# EAGLE schematic Battery-Connection (EAGLE 9.6.2)
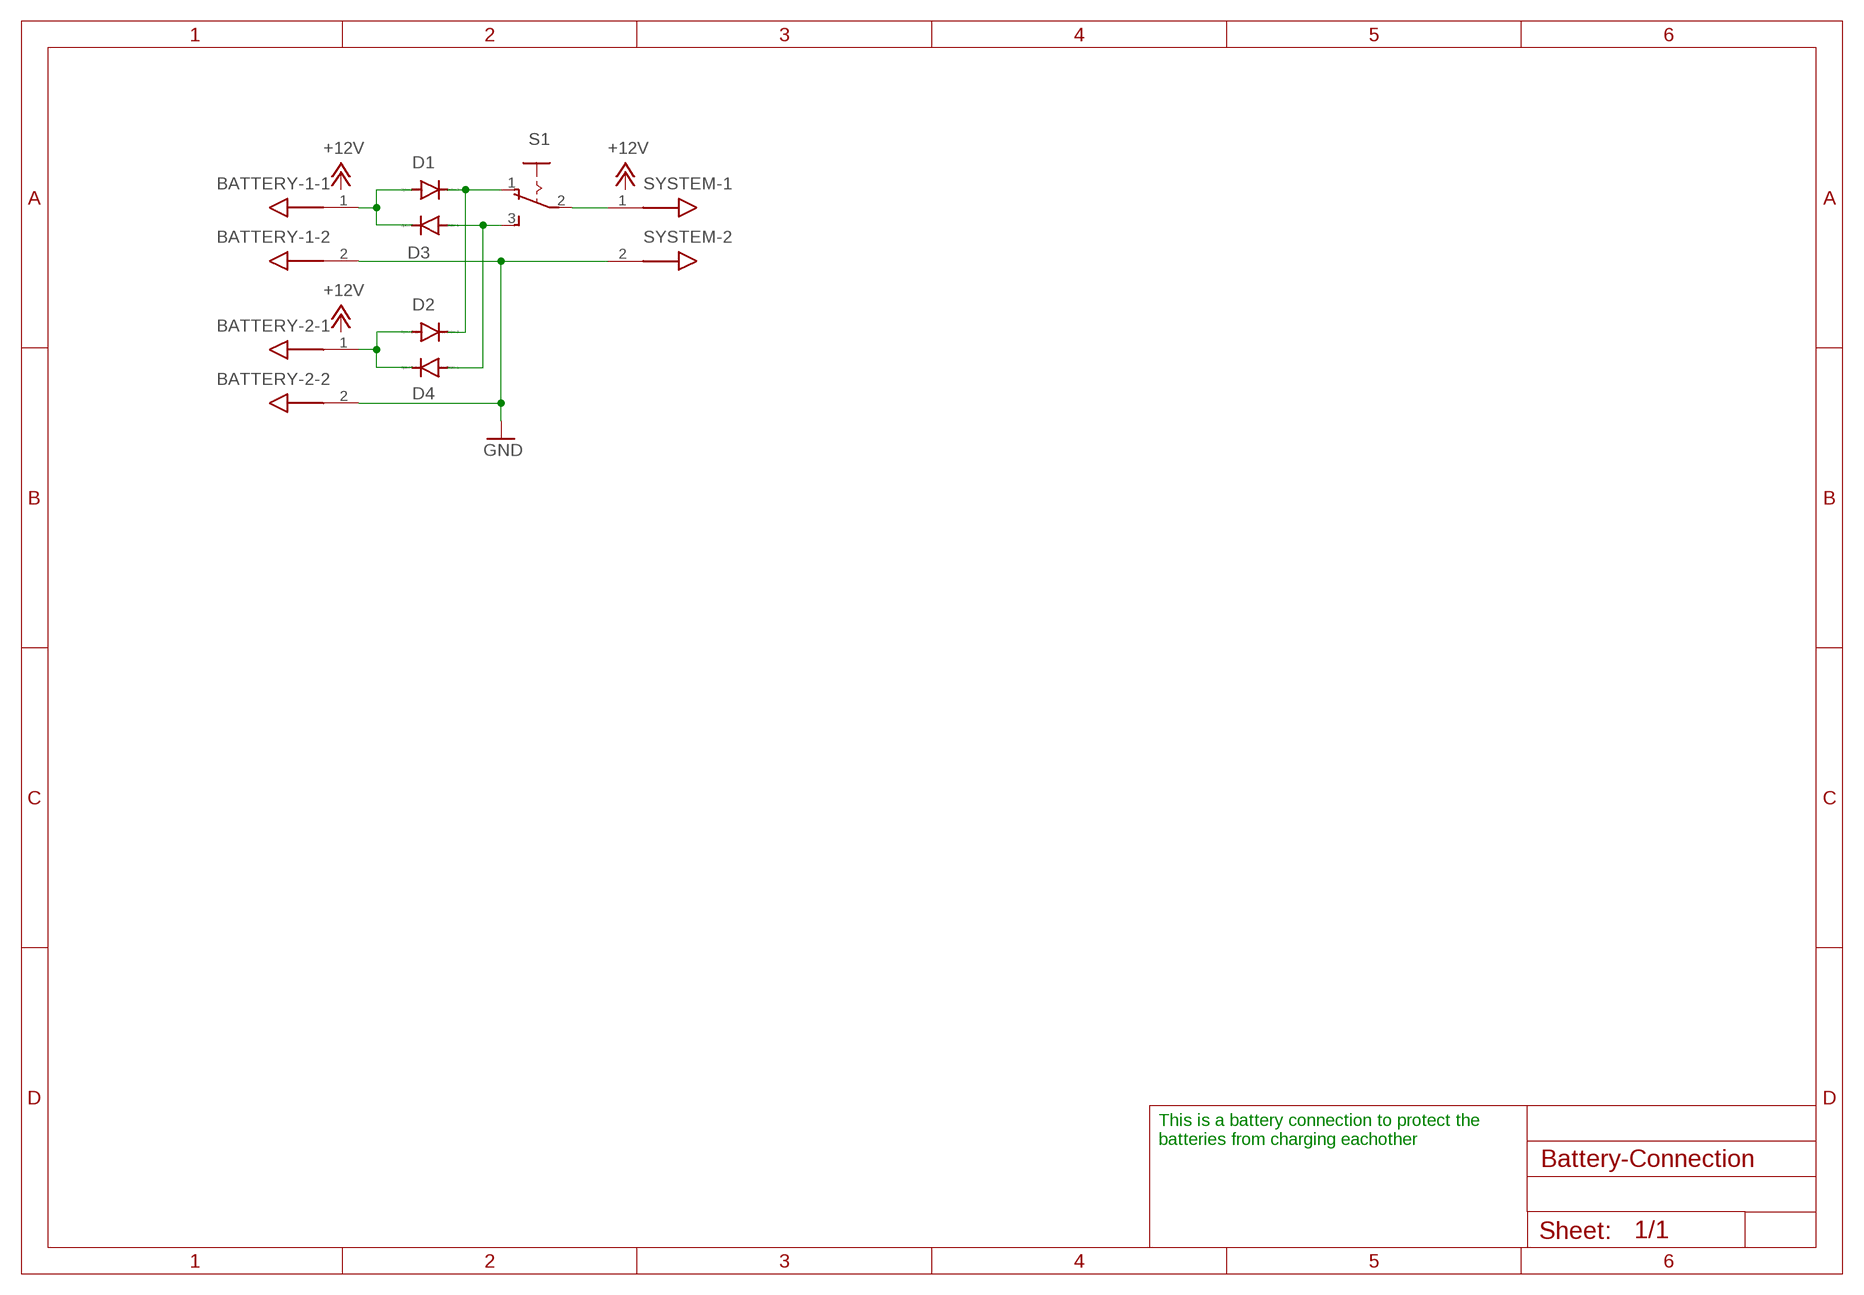
[diagram p0: schematic, sheet 1]

## Parts
BATTERY-1  0026604020  [KK41791-4020_2-PIN]
BATTERY-2  0026604020  [KK41791-4020_2-PIN]
D1  1N4942  [DO41-10]
D2  1N4942  [DO41-10]
D3  1N4942  [DO41-10]
D4  1N4942  [DO41-10]
S1  255SB  [255SB]
SYSTEM  0026604020  [KK41791-4020_2-PIN]

## Nets
GND: BATTERY-1.2 BATTERY-2.2 SYSTEM.2
N$1: BATTERY-2.1 D2.A D4.C
N$2: BATTERY-1.1 D1.A D3.C
N$3: D3.A D4.A S1.3(S)
N$4: D1.C D2.C S1.1(O)
N$5: S1.2(P) SYSTEM.1

## Notes on the sheet
- This is a battery connection to protect the
  batteries from charging eachother

## Library data of the parts
BATTERY-1 BATTERY-2 SYSTEM = molex:0026604020: KK® 396 Header, Vertical, Friction Lock, 2 Circuits, Tin (Sn) Plating KK® Interconnect System Documentation Drawing <http://www.molex.com/pdm_docs/sd/026604020_sd.pdf>; CATEGORY: Connectors, Interconnects; COLOR: Natural; CONNECTOR_TYPE: Header, Unshrouded; CONTACT_FINISH: Tin; CONTACT_FINISH_THICKNESS: 60µin (1.52µm); CONTACT_MATING_LENGTH: 0.450" (11.43mm); CONTACT_TYPE: Male Pin; DESCRIPTION: CONN HEADER 2POS .156 VERT TIN; DOCUMENTATION_LINK: <a href="http://www.molex.com/pdm_docs/sd/026604020_sd.pdf">Datasheet</a>; DOCUMENTATION_URL: http://www.molex.com/pdm_docs/sd/026604020_sd.pdf; FAMILY: Rectangular Connectors - Headers, Male Pins; FASTENING_TYPE: Friction Lock; FEATURES: -; MANUFACTURER: Molex Inc; MOUNTING_TYPE: Through Hole; NUMBER_OF_POSITIONS: 2; NUMBER_OF_POSITIONS_LOADED: All; NUMBER_OF_ROWS: 1; PART_NUMBER: 0026604020; PITCH: 0.156" (3.96mm); ROW_SPACING: -; SERIES: KK® 41791; SUPPLIER_ITEM_LINK: <a href="http://www.digikey.com/product-search/en?KeyWords=0026604020&WT.z_header=search_go">Details</a>; SUPPLIER_ITEM_NUMBER: WM4620-ND; SUPPLIER_ITEM_URL: http://www.digikey.com/product-search/en?KeyWords=0026604020&WT.z_header=search_go; SUPPLIER_LINK: <a href="http://www.digikey.com">Home Page</a>; SUPPLIER_NAME: Digi-Key; SUPPLIER_URL: http://www.digikey.com; TERMINATION: Solder
D1-D4 = diode:1N4942: DIODE 1.0 A, 200 V, 150 ns
S1 = switch:255SB: SLIDING SWITCH Distributor Buerklin, 11G810